# Altium schematic sheet Isolated_Power_supply.SchDoc: Power Supply (part 1 of 3)
size A2; Author: M.Beldyga; CompanyName: WUT ISE; DrawnBy: M.Beldyga; Organization: WUT ISE; Address1: PW ISE; Address2: Nowowiejska 15/19 00-665 Warsaw; Address3: micbeldyga@gmail.com; SheetNumber: 8; SheetTotal: 10; ModifiedBy: -; CheckedDate: -; Title2: LLC + LDO; DivGrp: WUT ISE; Designer: M.Beldyga; ModifiedDate: -; ProjectName: Sensor Box
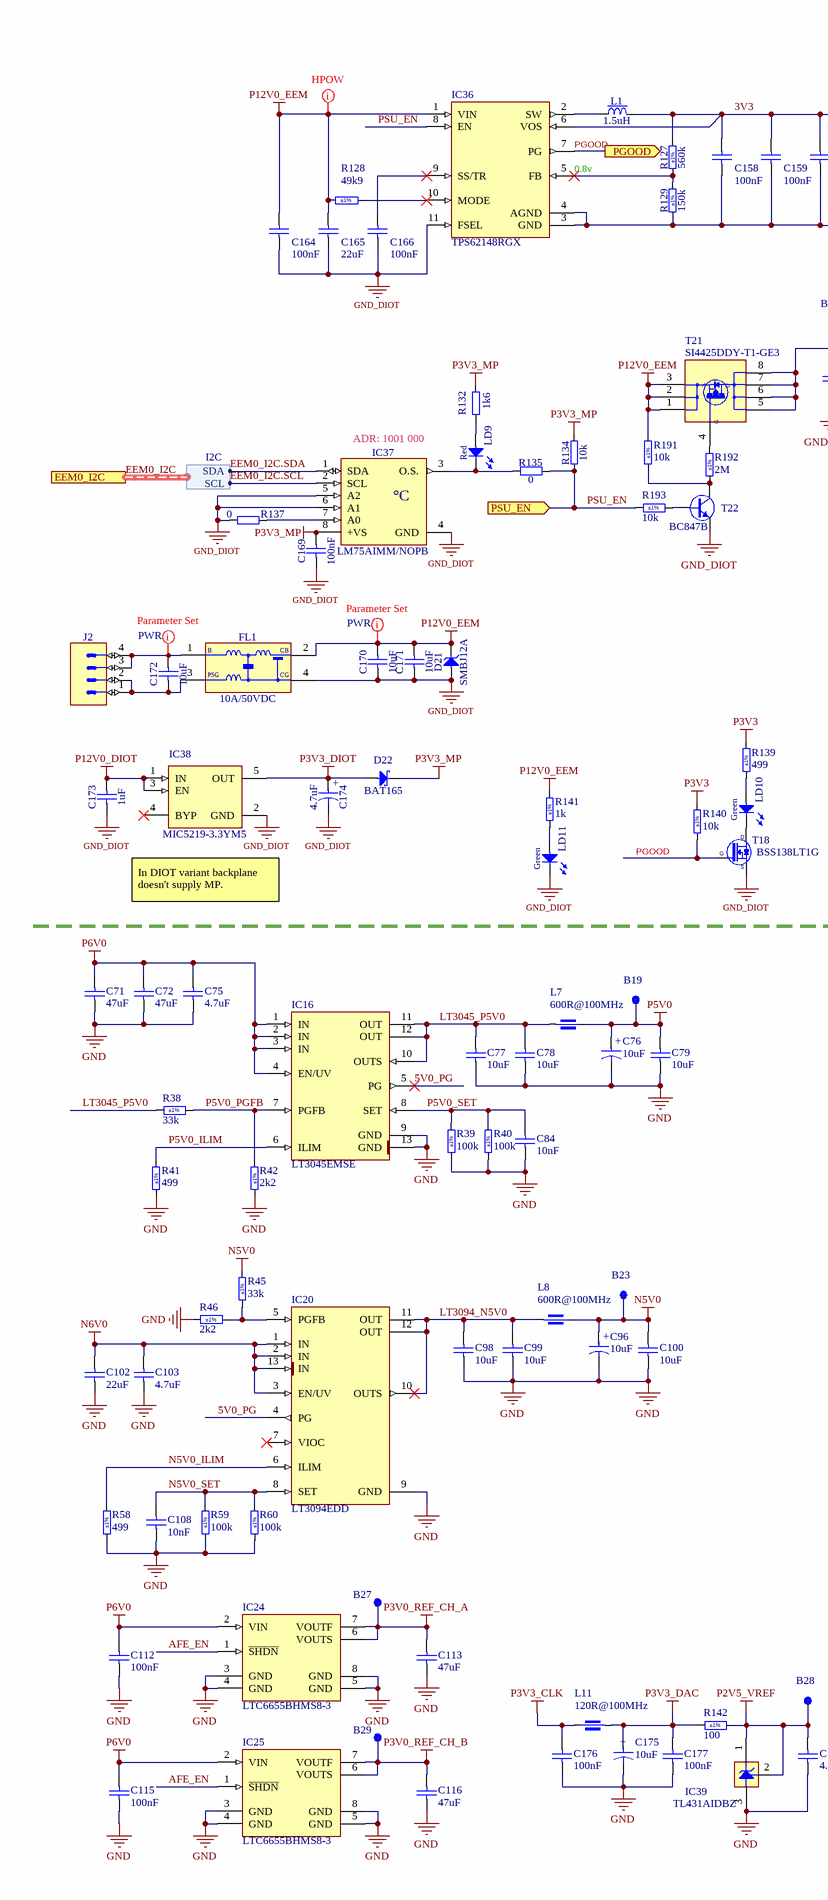
[diagram p0: Isolated_Power_supply.SchDoc, left]
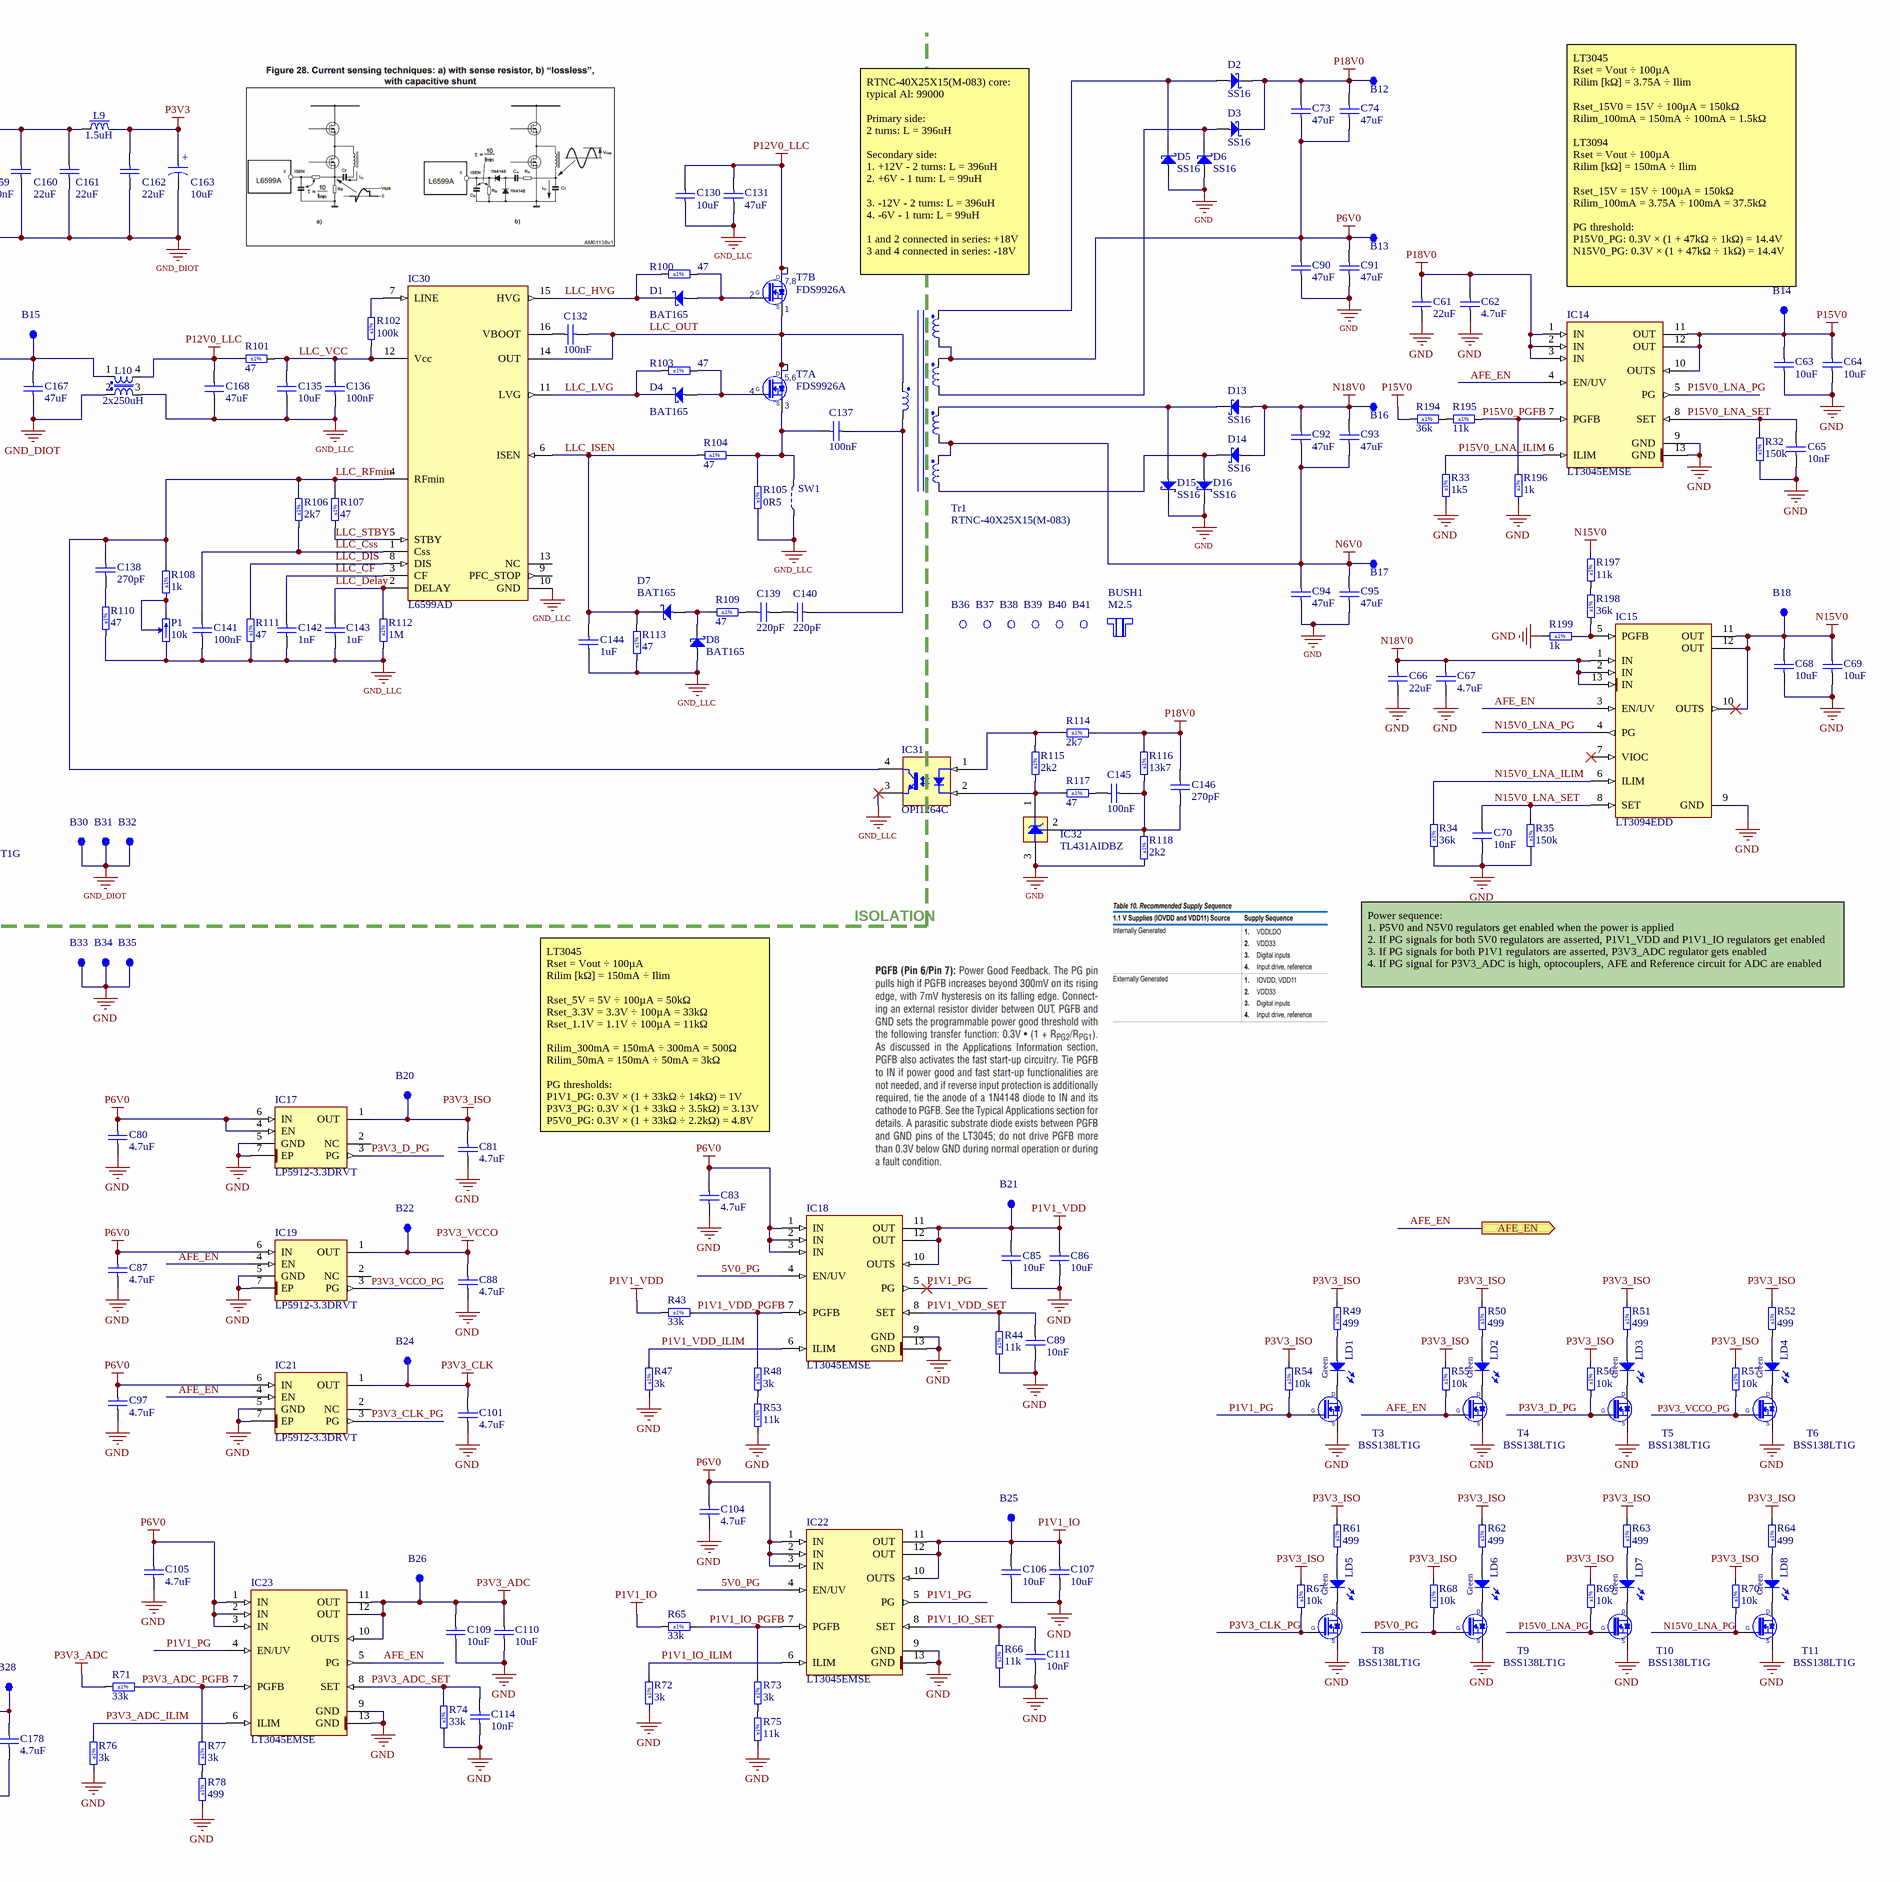
[diagram p1: Isolated_Power_supply.SchDoc, right]

## Parts
B12  SMD Pad  [C100]  (value not drawn)  (no BOM)
B13  SMD Pad  [C100]  (value not drawn)  (no BOM)
B14  SMD Pad  [C100]  (value not drawn)  (no BOM)
B15  SMD Pad  [C100]  (value not drawn)  (no BOM)
B16  SMD Pad  [C100]  (value not drawn)  (no BOM)
B17  SMD Pad  [C100]  (value not drawn)  (no BOM)
B18  SMD Pad  [C100]  (value not drawn)  (no BOM)
B19  SMD Pad  [C100]  (value not drawn)  (no BOM)
B20  SMD Pad  [C100]  (value not drawn)  (no BOM)
B21  SMD Pad  [C100]  (value not drawn)  (no BOM)
B22  SMD Pad  [C100]  (value not drawn)  (no BOM)
B23  SMD Pad  [C100]  (value not drawn)  (no BOM)
B24  SMD Pad  [C100]  (value not drawn)  (no BOM)
B25  SMD Pad  [C100]  (value not drawn)  (no BOM)
B26  SMD Pad  [C100]  (value not drawn)  (no BOM)
B27  SMD Pad  [C100]  (value not drawn)  (no BOM)
B28  SMD Pad  [C100]  (value not drawn)  (no BOM)
B29  SMD Pad  [C100]  (value not drawn)  (no BOM)
B30  SMD Pad  [C100]  (value not drawn)  (no BOM)
B31  SMD Pad  [C100]  (value not drawn)  (no BOM)
B32  SMD Pad  [C100]  (value not drawn)  (no BOM)
B33  SMD Pad  [C100]  (value not drawn)  (no BOM)
B34  SMD Pad  [C100]  (value not drawn)  (no BOM)
B35  SMD Pad  [C100]  (value not drawn)  (no BOM)
B36  Non Plated Hole  [MTG300]  (value not drawn)  (no BOM)
B37  Non Plated Hole  [MTG300]  (value not drawn)  (no BOM)
B38  Non Plated Hole  [MTG300]  (value not drawn)  (no BOM)
B39  Non Plated Hole  [MTG300]  (value not drawn)  (no BOM)
B40  Non Plated Hole  [MTG300]  (value not drawn)  (no BOM)
B41  Non Plated Hole  [MTG300]  (value not drawn)  (no BOM)
BUSH1  M2.5  [WURTH_9774010151]
C61  22uF  [CAPC2012X135N]
C62  4.7uF  [CAPC1608X90N]
C63  10uF  [CAPC2012X95N]
C64  10uF  [CAPC2012X95N]
C65  10nF  [CAPC1005X55N]
C66  22uF  [CAPC2012X135N]
C67  4.7uF  [CAPC1608X90N]
C68  10uF  [CAPC2012X95N]
C69  10uF  [CAPC2012X95N]
C70  10nF  [CAPC1005X55N]
C71  47uF  [CAPC3216X180N]
C72  47uF  [CAPC3216X180N]
C73  47uF  [CAPC3216X180N]
C74  47uF  [CAPC3216X180N]
C75  4.7uF  [CAPC1608X90N]
C76  10uF  [CAPMP3216X180N]
C77  10uF  [CAPC2012X95N]
C78  10uF  [CAPC2012X95N]
C79  10uF  [CAPC2012X95N]
C80  4.7uF  [CAPC1608X90N]
C81  4.7uF  [CAPC1608X90N]
C83  4.7uF  [CAPC1608X90N]
C84  10nF  [CAPC1005X55N]
C85  10uF  [CAPC2012X95N]
C86  10uF  [CAPC2012X95N]
C87  4.7uF  [CAPC1608X90N]
C88  4.7uF  [CAPC1608X90N]
C89  10nF  [CAPC1005X55N]
C90  47uF  [CAPC3216X180N]
C91  47uF  [CAPC3216X180N]
C92  47uF  [CAPC3216X180N]
C93  47uF  [CAPC3216X180N]
C94  47uF  [CAPC3216X180N]
C95  47uF  [CAPC3216X180N]
C96  10uF  [CAPMP3216X180N]
C97  4.7uF  [CAPC1608X90N]
C98  10uF  [CAPC2012X95N]
C99  10uF  [CAPC2012X95N]
C100  10uF  [CAPC2012X95N]
C101  4.7uF  [CAPC1608X90N]
C102  22uF  [CAPC2012X135N]
C103  4.7uF  [CAPC1608X90N]
C104  4.7uF  [CAPC1608X90N]
C105  4.7uF  [CAPC1608X90N]
C106  10uF  [CAPC2012X95N]
C107  10uF  [CAPC2012X95N]
C108  10nF  [CAPC1005X55N]
C109  10uF  [CAPC2012X95N]
C110  10uF  [CAPC2012X95N]
C111  10nF  [CAPC1005X55N]
C112  100nF  [CAPC1005X55N]
C113  47uF  [CAPC2012X140N]
C114  10nF  [CAPC1005X55N]
C115  100nF  [CAPC1005X55N]
C116  47uF  [CAPC2012X140N]
C130  10uF  [CAPC3216X180N]
C131  47uF  [CAPC3216X180N]
C132  100nF  [CAPC1005X55N]
C135  10uF  [CAPC3216X180N]
C136  100nF  [CAPC1005X55N]
C137  100nF  [CAPC4532X250N]
C138  270pF  [CAPC1608X87N]
C139  220pF  [CAPC3225X200N]
C140  220pF  [CAPC3225X200N]
C141  100nF  [CAPC1005X55N]
C142  1nF  [CAPC1608X90N]
C143  1uF  [CAPC1608X87N]
C144  1uF  [CAPC1608X87N]
C145  100nF  [CAPC1005X55N]
C146  270pF  [CAPC1608X87N]
C158  100nF  [CAPC1005X55N]
C159  100nF  [CAPC1005X55N]
C160  22uF  [CAPC2012X135N]
C161  22uF  [CAPC2012X135N]
C162  22uF  [CAPC2012X135N]
C163  10uF  [CAPMP3216X180N]
C164  100nF  [CAPC1005X55N]
C165  22uF  [CAPC2012X135N]
C166  100nF  [CAPC1005X55N]
C167  47uF  [CAPC3216X180N]
C168  47uF  [CAPC3216X180N]
C169  100nF  [CAPC1005X55N]
C170  10uF  [CAPC2012X95N]
C171  10uF  [CAPC2012X95N]
C172  10uF  [CAPC2012X95N]
C173  1uF  [CAPC1608X87N]
C174  4.7uF  [CAPMP3216X180N]
C175  10uF  [CAPMP3216X180N]
C176  100nF  [CAPC1005X55N]
C177  100nF  [CAPC1005X55N]
C178  4.7uF  [CAPC1608X90N]
D1  BAT165  [SOD2512X110N]
D2  SS16  [DIOM5127X229N]
D3  SS16  [DIOM5127X229N]
D4  BAT165  [SOD2512X110N]
D5  SS16  [DIOM5127X229N]
D6  SS16  [DIOM5127X229N]
D7  BAT165  [SOD2512X110N]
D8  BAT165  [SOD2512X110N]
D13  SS16  [DIOM5127X229N]
D14  SS16  [DIOM5127X229N]
D15  SS16  [DIOM5127X229N]
D16  SS16  [DIOM5127X229N]
D21  SMBJ12A  [DIOM5336X265N]
D22  BAT165  [SOD2512X110N]
FL1  10A/50VDC  [FIL_MURATA_BNX02]
IC14  LT3045EMSE  [SOP65P490X110-13N-R175X294]
IC15  LT3094EDD  [SON45P300X300X80-13N-R175X248]
IC16  LT3045EMSE  [SOP65P490X110-13N-R175X294]
IC17  LP5912-3.3DRVT  [SON65P200X200X80-7N-R110X170]
IC18  LT3045EMSE  [SOP65P490X110-13N-R175X294]
IC19  LP5912-3.3DRVT  [SON65P200X200X80-7N-R110X170]
IC20  LT3094EDD  [SON45P300X300X80-13N-R175X248]
IC21  LP5912-3.3DRVT  [SON65P200X200X80-7N-R110X170]
IC22  LT3045EMSE  [SOP65P490X110-13N-R175X294]
IC23  LT3045EMSE  [SOP65P490X110-13N-R175X294]
IC24  LTC6655BHMS8-3  [SOP65P490X110-8N]
IC25  LTC6655BHMS8-3  [SOP65P490X110-8N]
IC30  L6599AD  [SOP127P600X175-16N]
IC31  OPI1264C  [OPI1264C]
IC32  TL431AIDBZ  [SOT95P237X112-3N]
IC36  TPS62148RGX  [TEXAS_RGX0011A]
IC37  LM75AIMM/NOPB  [SOP65P490X109-8N]
IC38  MIC5219-3.3YM5  [SOT95P280X145-5N]
IC39  TL431AIDBZ  [SOT95P237X112-3N]
J2  Mini-Fit Jr.™  [MOLEX_39-30-0040]  (value not drawn)
L1  1.5uH  [IND_WURTH_WE-LHMI_7050]
L7  600R@100MHz  [INDC1608X95N]
L8  600R@100MHz  [INDC1608X95N]
L9  1.5uH  [IND_WURTH_WE-LHMI_7050]
L10  2x250uH  [IND_WURTH_WE-SL2]
L11  120R@100MHz  [INDC1608X65N]
LD1  Green  [LED_KINGBRIGHT_KP-1608CGCK]
LD2  Green  [LED_KINGBRIGHT_KP-1608CGCK]
LD3  Green  [LED_KINGBRIGHT_KP-1608CGCK]
LD4  Green  [LED_KINGBRIGHT_KP-1608CGCK]
LD5  Green  [LED_KINGBRIGHT_KP-1608CGCK]
LD6  Green  [LED_KINGBRIGHT_KP-1608CGCK]
LD7  Green  [LED_KINGBRIGHT_KP-1608CGCK]
LD8  Green  [LED_KINGBRIGHT_KP-1608CGCK]
LD9  Red  [LED_AVAGO_HSMC-C110]
LD10  Green  [LED_KINGBRIGHT_KP-1608CGCK]
LD11  Green  [LED_AVAGO_HSME-C110]
P1  10k  [TRIM_BOURNS_3314G-1]
R32  150k  Tolerance: ±1%  [RESC1005X40N]
R33  1k5  Tolerance: ±1%  [RESC1005X40N]
R34  36k  Tolerance: ±1%  [RESC1005X40N]
R35  150k  Tolerance: ±1%  [RESC1005X40N]
R38  33k  Tolerance: ±1%  [RESC1005X40N]
R39  100k  Tolerance: ±1%  [RESC1005X40N]
R40  100k  Tolerance: ±1%  [RESC1005X40N]
R41  499  Tolerance: ±1%  [RESC1005X40N]
R42  2k2  Tolerance: ±1%  [RESC1005X40N]
R43  33k  Tolerance: ±1%  [RESC1005X40N]
R44  11k  Tolerance: ±1%  [RESC1005X40N]
R45  33k  Tolerance: ±1%  [RESC1005X40N]
R46  2k2  Tolerance: ±1%  [RESC1005X40N]
R47  3k  Tolerance: ±1%  [RESC1005X40N]
R48  3k  Tolerance: ±1%  [RESC1005X40N]
R49  499  Tolerance: ±1%  [RESC1005X40N]
R50  499  Tolerance: ±1%  [RESC1005X40N]
R51  499  Tolerance: ±1%  [RESC1005X40N]
R52  499  Tolerance: ±1%  [RESC1005X40N]
R53  11k  Tolerance: ±1%  [RESC1005X40N]
R54  10k  Tolerance: ±1%  [RESC1005X40N]
R55  10k  Tolerance: ±1%  [RESC1005X40N]
R56  10k  Tolerance: ±1%  [RESC1005X40N]
R57  10k  Tolerance: ±1%  [RESC1005X40N]
R58  499  Tolerance: ±1%  [RESC1005X40N]
R59  100k  Tolerance: ±1%  [RESC1005X40N]
R60  100k  Tolerance: ±1%  [RESC1005X40N]
R61  499  Tolerance: ±1%  [RESC1005X40N]
R62  499  Tolerance: ±1%  [RESC1005X40N]
R63  499  Tolerance: ±1%  [RESC1005X40N]
R64  499  Tolerance: ±1%  [RESC1005X40N]
R65  33k  Tolerance: ±1%  [RESC1005X40N]
R66  11k  Tolerance: ±1%  [RESC1005X40N]
R67  10k  Tolerance: ±1%  [RESC1005X40N]
R68  10k  Tolerance: ±1%  [RESC1005X40N]
R69  10k  Tolerance: ±1%  [RESC1005X40N]
R70  10k  Tolerance: ±1%  [RESC1005X40N]
R71  33k  Tolerance: ±1%  [RESC1005X40N]
R72  3k  Tolerance: ±1%  [RESC1005X40N]
R73  3k  Tolerance: ±1%  [RESC1005X40N]
R74  33k  Tolerance: ±1%  [RESC1005X40N]
R75  11k  Tolerance: ±1%  [RESC1005X40N]
R76  3k  Tolerance: ±1%  [RESC1005X40N]
R77  3k  Tolerance: ±1%  [RESC1005X40N]
R78  499  Tolerance: ±1%  [RESC1005X40N]
R100  47  Tolerance: ±1%  [RESC1608X55N]
R101  47  Tolerance: ±1%  [RESC1608X55N]
R102  100k  Tolerance: ±1%  [RESC1005X40N]
R103  47  Tolerance: ±1%  [RESC1608X55N]
R104  47  Tolerance: ±1%  [RESC1608X55N]
R105  0R5  Tolerance: ±1%  [RESC6532X80N]
R106  2k7  Tolerance: ±1%  [RESC1608X55N]
R107  47  Tolerance: ±1%  [RESC1608X55N]
R108  1k  Tolerance: ±1%  [RESC1005X40N]
R109  47  Tolerance: ±1%  [RESC1608X55N]
R110  47  Tolerance: ±1%  [RESC1608X55N]
R111  47  Tolerance: ±1%  [RESC1608X55N]
R112  1M  Tolerance: ±1%  [RESC1608X55N]
R113  47  Tolerance: ±1%  [RESC1608X55N]
R114  2k7  Tolerance: ±1%  [RESC1608X55N]
R115  2k2  Tolerance: ±1%  [RESC1005X40N]
R116  13k7  Tolerance: ±1%  [RESC1608X55N]
R117  47  Tolerance: ±1%  [RESC1608X55N]
R118  2k2  Tolerance: ±1%  [RESC1005X40N]
R127  560k  Tolerance: ±1%  [RESC1608X55N]
R128  49k9  Tolerance: ±1%  [RESC1608X55N]
R129  150k  Tolerance: ±1%  [RESC1608X55N]
R132  1k6  [RESC1005X40N]
R134  10k  [RESC1608X55N]
R135  0  [RESC1005X40N]
R137  0  [RESC1005X40N]
R139  499  Tolerance: ±1%  [RESC1005X40N]
R140  10k  Tolerance: ±1%  [RESC1005X40N]
R141  1k  Tolerance: ±1%  [RESC1005X40N]
R142  100  Tolerance: ±1%  [RESC1005X40N]
R191  10k  Tolerance: ±1%  [RESC1005X40N]
R192  2M  Tolerance: ±1%  [RESC1005X40N]
R193  10k  Tolerance: ±1%  [RESC1005X40N]
R194  36k  Tolerance: ±1%  [RESC1005X40N]
R195  11k  Tolerance: ±1%  [RESC1005X40N]
R196  1k  Tolerance: ±1%  [RESC1005X40N]
R197  11k  Tolerance: ±1%  [RESC1005X40N]
R198  36k  Tolerance: ±1%  [RESC1005X40N]
R199  1k  Tolerance: ±1%  [RESC1005X40N]
SW1  Switch  [JUMPSMD0805_G50]  (value not drawn)  (no BOM)
T3  BSS138LT1G  [SOT95P240X110-3N]
T4  BSS138LT1G  [SOT95P240X110-3N]
T5  BSS138LT1G  [SOT95P240X110-3N]
T6  BSS138LT1G  [SOT95P240X110-3N]
T7  FDS9926A  [SOIC127P600X175-8N]  (parts A,B of 2)
T8  BSS138LT1G  [SOT95P240X110-3N]
T9  BSS138LT1G  [SOT95P240X110-3N]
T10  BSS138LT1G  [SOT95P240X110-3N]
T11  BSS138LT1G  [SOT95P240X110-3N]
T18  BSS138LT1G  [SOT95P240X110-3N]
T21  SI4425DDY-T1-GE3  [SOIC127P600X175-8N]
T22  BC847B  [SOT95P230X110-3N]
Tr1  RTNC-40X25X15(M-083)  [RTNC-40X25X15(M-083)]

## Ports
AFE_EN (out), EEM0_I2C (harness I2C), PGOOD (out), PSU_EN (in)

## Harnesses
I2C: SDA, SCL

## Nets
GND: B33.1 B34.1 B35.1 C61.1 C62.1 C63.1 C64.1 C65.1 C66.1 C67.1 C68.1 C69.1 C70.1 C71.1 C72.1 C75.1 C76.2 C77.1 C78.1 C79.1 C80.1 C81.1 C83.1 C84.1 C85.1 C86.1 C87.1 C88.1 C89.1 C90.2 C91.2 C94.2 C95.2 C96.2 C97.1 C98.1 C99.1 C100.1 C101.1 C102.1 C103.1 C104.1 C105.1 C106.1 C107.1 C108.1 C109.1 C110.1 C111.1 C112.1 C113.1 C114.1 C115.1 C116.1 C175.2 C176.1 C177.1 C178.1 D5.2(A) D6.2(A) D15.1(C) D16.1(C) IC14.9(GND) IC14.13(GND) IC15.9(GND) IC16.9(GND) IC16.13(GND) IC17.5(GND) IC17.7(EP) IC18.9(GND) IC18.13(GND) IC19.5(GND) IC19.7(EP) IC20.9(GND) IC21.5(GND) IC21.7(EP) IC22.9(GND) IC22.13(GND) IC23.9(GND) IC23.13(GND) IC24.3(GND) IC24.4(GND) IC24.5(GND) IC24.8(GND) IC25.3(GND) IC25.4(GND) IC25.5(GND) IC25.8(GND) IC32.3(A) IC39.3(A) R32.1 R33.1 R34.1 R35.1 R39.1 R40.1 R41.1 R42.1 R44.1 R46.2 R47.1 R53.1 R58.1 R59.1 R60.1 R66.1 R72.1 R74.1 R75.1 R76.1 R78.1 R118.1 R196.1 R199.2 T3.2(S) T4.2(S) T5.2(S) T6.2(S) T8.2(S) T9.2(S) T10.2(S) T11.2(S)
GND_DIOT: B30.1 B31.1 B32.1 C158.1 C159.1 C160.1 C161.1 C162.1 C163.2 C164.1 C165.1 C166.1 C167.1 C169.1 C170.1 C171.1 C173.1 C174.2 D21.2(A) FL1.4(CG) IC36.3(GND) IC36.4(AGND) IC36.11(FSEL) IC37.4(GND) IC37.5(A2) IC37.6(A1) IC38.2(GND) L10.2 LD11.1(C) R129.1 R137.1 T18.2(S) T22.2(E)
GND_LLC: C130.2 C131.2 C135.2 C136.1 C141.2 C142.1 C143.1 C144.1 C168.1 D8.2(A) IC30.10(GND) IC31.3(E) L10.3 P1.1(CCW) R105.1 R110.1 R111.1 R112.1 R113.1 SW1.1
N5V0: B23.1 C96.1 C100.2 L8.2 R45.2
N6V0: B17.1 C92.2 C93.2 C94.1 C95.1 C102.2 C103.2 IC20.1(IN) IC20.2(IN) IC20.3(EN/UV) IC20.13(IN) Tr1.8 Tr1.9
N15V0: B18.1 C68.2 C69.2 IC15.10(OUTS) IC15.11(OUT) IC15.12(OUT) R197.2
N18V0: B16.1 C66.2 C67.2 C92.1 C93.1 D13.2(A) D14.2(A) IC15.1(IN) IC15.2(IN) IC15.13(IN)
P1V1_IO: B25.1 C106.2 C107.2 IC22.10(OUTS) IC22.11(OUT) IC22.12(OUT) R65.2
P1V1_VDD: B21.1 C85.2 C86.2 IC18.10(OUTS) IC18.11(OUT) IC18.12(OUT) R43.2
P2V5_VREF: B28.1 C178.2 IC39.1(C) IC39.2(Adj) R142.1
P3V0_REF_CH_A: B27.1 C113.2 IC24.6(VOUTS) IC24.7(VOUTF)
P3V0_REF_CH_B: B29.1 C116.2 IC25.6(VOUTS) IC25.7(VOUTF)
P3V3: C162.2 C163.1 L9.2 R139.2 R140.2
P3V3_ADC: B26.1 C109.2 C110.2 IC23.10(OUTS) IC23.11(OUT) IC23.12(OUT) R71.2
P3V3_CLK: B24.1 C101.2 C176.2 IC21.1(OUT) L11.2
P3V3_DAC: C175.1 C177.2 L11.1 R142.2
P3V3_DIOT: C174.1 D22.2(A) IC38.5(OUT)
P3V3_ISO: B20.1 C81.2 IC17.1(OUT) R49.2 R50.2 R51.2 R52.2 R54.2 R55.2 R56.2 R57.2 R61.2 R62.2 R63.2 R64.2 R67.2 R68.2 R69.2 R70.2
P3V3_MP: C169.2 D22.1(C) IC37.8(+VS) R132.2 R134.2
P3V3_VCCO: B22.1 C88.2 IC19.1(OUT)
P5V0: B19.1 C76.1 C79.2 L7.2
P6V0: B13.1 C71.2 C72.2 C73.2 C74.2 C75.2 C80.2 C83.2 C87.2 C90.1 C91.1 C97.2 C104.2 C105.2 C112.2 C115.2 IC16.1(IN) IC16.2(IN) IC16.3(IN) IC16.4(EN/UV) IC17.4(EN) IC17.6(IN) IC18.1(IN) IC18.2(IN) IC18.3(IN) IC19.6(IN) IC21.6(IN) IC22.1(IN) IC22.2(IN) IC22.3(IN) IC23.1(IN) IC23.2(IN) IC23.3(IN) IC24.2(VIN) IC25.2(VIN) Tr1.4 Tr1.5
P12V0_DIOT: C173.2 IC38.1(IN) IC38.3(EN)
P12V0_EEM: C164.2 C165.2 C170.2 C171.2 D21.1(C) FL1.2(CB) IC36.1(VIN) R128.1 R141.2 R191.1 T21.1(S) T21.2(S) T21.3(S)
P12V0_LLC: C130.1 C131.1 C168.2 L10.4 R101.2 T7.7(D) T7.8(D)
P15V0: B14.1 C63.2 C64.2 IC14.10(OUTS) IC14.11(OUT) IC14.12(OUT) R194.1
P18V0: B12.1 C61.2 C62.2 C73.1 C74.1 C146.2 D2.1(C) D3.1(C) IC14.1(IN) IC14.2(IN) IC14.3(IN) R114.1 R116.2
3V3: C158.2 C159.2 C160.2 C161.2 IC36.6(VOS) L1.2 L9.1 R127.2
5V0_PG: IC16.5(PG) IC18.4(EN/UV) IC20.4(PG) IC22.4(EN/UV)
AFE_EN: IC14.4(EN/UV) IC15.3(EN/UV) IC19.4(EN) IC21.4(EN) IC23.5(PG) IC24.1(~{SHDN}) IC25.1(~{SHDN}) R55.1 T4.1(G) ; port AFE_EN
EEM0_I2C.SCL: IC37.2(SCL) ; port EEM0_I2C.SCL
EEM0_I2C.SDA: IC37.1(SDA) ; port EEM0_I2C.SDA
LLC_CF: C142.2 IC30.3(CF)
LLC_Css: C141.1 IC30.1(Css) R106.1
LLC_Delay: C143.2 IC30.2(DELAY) R112.2
LLC_DIS: IC30.8(DIS) R111.2
LLC_HVG: D1.1(C) IC30.15(HVG) R100.1
LLC_ISEN: C144.2 D7.1(C) IC30.6(ISEN) R104.2 R113.2
LLC_LVG: D4.1(C) IC30.11(LVG) R103.1
LLC_OUT: C132.1 IC30.14(OUT) T7.1(S) T7.5(D) T7.6(D) Tr1.1
LLC_RFmin: C138.2 IC30.4(RFmin) IC31.4(C) R106.2 R107.2 R108.2
LLC_STBY: IC30.5(STBY) R107.1
LLC_VCC: C135.1 C136.2 IC30.12(Vcc) R101.1 R102.1
LT3045_P5V0: C77.2 C78.2 IC16.10(OUTS) IC16.11(OUT) IC16.12(OUT) L7.1 R38.2
LT3094_N5V0: C98.2 C99.2 IC20.10(OUTS) IC20.11(OUT) IC20.12(OUT) L8.1
N5V0_ILIM: IC20.6(ILIM) R58.2
N5V0_SET: C108.2 IC20.8(SET) R59.2 R60.2
N15V0_LNA_ILIM: IC15.6(ILIM) R34.2
N15V0_LNA_PG: IC15.4(PG) R70.1 T11.1(G)
N15V0_LNA_SET: C70.2 IC15.8(SET) R35.2
P1V1_IO_ILIM: IC22.6(ILIM) R72.2
P1V1_IO_PGFB: IC22.7(PGFB) R65.1 R73.2
P1V1_IO_SET: C111.2 IC22.8(SET) R66.2
P1V1_PG: IC18.5(PG) IC22.5(PG) IC23.4(EN/UV) R54.1 T3.1(G)
P1V1_VDD_ILIM: IC18.6(ILIM) R47.2
P1V1_VDD_PGFB: IC18.7(PGFB) R43.1 R48.2
P1V1_VDD_SET: C89.2 IC18.8(SET) R44.2
P3V3_ADC_ILIM: IC23.6(ILIM) R76.2
P3V3_ADC_PGFB: IC23.7(PGFB) R71.1 R77.2
P3V3_ADC_SET: C114.2 IC23.8(SET) R74.2
P3V3_CLK_PG: IC21.3(PG) R67.1 T8.1(G)
P3V3_D_PG: IC17.3(PG) R56.1 T5.1(G)
P3V3_VCCO_PG: IC19.3(PG) R57.1 T6.1(G)
P5V0_ILIM: IC16.6(ILIM) R41.2
P5V0_PG: R68.1 T9.1(G)
P5V0_PGFB: IC16.7(PGFB) R38.1 R42.2
P5V0_SET: C84.2 IC16.8(SET) R39.2 R40.2
P15V0_LNA_ILIM: IC14.6(ILIM) R33.2
P15V0_LNA_PG: IC14.5(PG) R69.1 T10.1(G)
P15V0_LNA_SET: C65.2 IC14.8(SET) R32.2
P15V0_PGFB: IC14.7(PGFB) R195.2 R196.2
PGOOD: IC36.7(PG) R140.1 T18.1(G) ; port PGOOD
PSU_EN: IC36.8(EN) R134.1 R135.2 R193.2 ; port PSU_EN
NetB15_1: B15.1 C167.2 L10.1 T21.5(D) T21.6(D) T21.7(D) T21.8(D)
NetC132_2: C132.2 IC30.16(VBOOT)
NetC137_1: C137.1 R104.1 R105.2 SW1.2 T7.3(S)
NetC137_2: C137.2 C140.2 Tr1.2
NetC138_1: C138.1 R110.2
NetC139_1: C139.1 R109.1
NetC139_2: C139.2 C140.1
NetC145_1: C145.1 C146.1 IC32.2(Adj) R116.1 R118.2
NetC145_2: C145.2 R117.1
NetC166_2: C166.2 IC36.9(SS/TR)
NetC172_1: C172.1 FL1.3(PSG) J2.1 J2.2
NetC172_2: C172.2 FL1.1(B) J2.3 J2.4
NetD1_2: D1.2(A) R100.2 T7.2(G)
NetD2_2: D2.2(A) D5.1(C) Tr1.3
NetD3_2: D3.2(A) D6.1(C) Tr1.6
NetD4_2: D4.2(A) R103.2 T7.4(G)
NetD7_2: D7.2(A) D8.1(C) R109.2
NetD13_1: D13.1(C) D15.2(A) Tr1.7
NetD14_1: D14.1(C) D16.2(A) Tr1.10
NetIC15_5: IC15.5(PGFB) R198.1 R199.1
NetIC20_5: IC20.5(PGFB) R45.1 R46.1
NetIC30_7: IC30.7(LINE) R102.2
NetIC31_1: IC31.1(A) R114.2 R115.2
NetIC31_2: IC31.2(C) IC32.1(C) R115.1 R117.2
NetIC36_2: IC36.2(SW) L1.1
NetIC36_5: IC36.5(FB) R127.1 R129.2
NetIC36_10: IC36.10(MODE) R128.2
NetIC37_3: IC37.3(O.S.) LD9.1(C) R135.1
NetIC37_7: IC37.7(A0) R137.2
NetLD1_1: LD1.1(C) T3.3(D)
NetLD1_2: LD1.2(A) R49.1
NetLD2_1: LD2.1(C) T4.3(D)
NetLD2_2: LD2.2(A) R50.1
NetLD3_1: LD3.1(C) T5.3(D)
NetLD3_2: LD3.2(A) R51.1
NetLD4_1: LD4.1(C) T6.3(D)
NetLD4_2: LD4.2(A) R52.1
NetLD5_1: LD5.1(C) T8.3(D)
NetLD5_2: LD5.2(A) R61.1
NetLD6_1: LD6.1(C) T9.3(D)
NetLD6_2: LD6.2(A) R62.1
NetLD7_1: LD7.1(C) T10.3(D)
NetLD7_2: LD7.2(A) R63.1
NetLD8_1: LD8.1(C) T11.3(D)
NetLD8_2: LD8.2(A) R64.1
NetLD9_2: LD9.2(A) R132.1
NetLD10_1: LD10.1(C) T18.3(D)
NetLD10_2: LD10.2(A) R139.1
NetLD11_2: LD11.2(A) R141.1
NetP1_2: P1.2(W) P1.3(CW) R108.1
NetR48_1: R48.1 R53.2
NetR73_1: R73.1 R75.2
NetR77_1: R77.1 R78.2
NetR191_2: R191.2 R192.1 T22.3(C)
NetR192_2: R192.2 T21.4(S)
NetR193_1: R193.1 T22.1(B)
NetR194_2: R194.2 R195.1
NetR197_1: R197.1 R198.2

Not connected (* = marked no-connect by the designer): B36 1; B37 1; B38 1; B39 1; B40 1; B41 1; BUSH1 1; IC15 7(VIOC)*; IC17 2(NC); IC19 2(NC); IC20 7(VIOC)*; IC21 2(NC); IC30 9(PFC_STOP) 13(NC); IC38 4(BYP)*

## Buses and harness runs
harness EEM0_I2C = port EEM0_I2C

## Layout directives
net class PWR: NetC172_2, P12V0_EEM
net class HPOW: P12V0_EEM

## Notes on the sheet
- (near IC36) 0.8v
- (near Tr1) RTNC-40X25X15(M-083) core:
  typical Al: 99000
  Primary side:
  2 turns: L = 396uH
  Secondary side:
  1. +12V - 2 turns: L = 396uH
  2. +6V - 1 turn: L = 99uH
  3. -12V - 2 turns: L = 396uH
  4. -6V - 1 turn: L = 99uH
  1 and 2 connected in series: +18V
  3 and 4 connected in series: -18V
- (near B14) LT3045
  Rset = Vout ÷ 100µA
  Rilim [kΩ] = 3.75A ÷ Ilim
  Rset_15V0 = 15V ÷ 100µA = 150kΩ
  Rilim_100mA = 150mA ÷ 100mA = 1.5kΩ
  LT3094
  Rset = Vout ÷ 100µA
  Rilim [kΩ] = 150mA ÷ Ilim
  Rset_15V = 15V ÷ 100µA = 150kΩ
  Rilim_100mA = 3.75A ÷ 100mA = 37.5kΩ
  PG threshold:
  P15V0_PG: 0.3V × (1 + 47kΩ ÷ 1kΩ) = 14.4V
  N15V0_PG: 0.3V × (1 + 47kΩ ÷ 1kΩ) = 14.4V
- (near IC37) ADR: 1001 000
- In DIOT variant backplane doesn't supply MP.
- ISOLATION
- Power sequence:
  1. P5V0 and N5V0 regulators get enabled when the power is applied
  2. If PG signals for both 5V0 regulators are asserted, P1V1_VDD and P1V1_IO regulators get enabled
  3. If PG signals for both P1V1 regulators are asserted, P3V3_ADC regulator gets enabled
  4. If PG signal for P3V3_ADC is high, optocouplers, AFE and Reference circuit for ADC are enabled
- LT3045
  Rset = Vout ÷ 100µA
  Rilim [kΩ] = 150mA ÷ Ilim
  Rset_5V = 5V ÷ 100µA = 50kΩ
  Rset_3.3V = 3.3V ÷ 100µA = 33kΩ
  Rset_1.1V = 1.1V ÷ 100µA = 11kΩ
  Rilim_300mA = 150mA ÷ 300mA = 500Ω
  Rilim_50mA = 150mA ÷ 50mA = 3kΩ
  PG thresholds:
  P1V1_PG: 0.3V × (1 + 33kΩ ÷ 14kΩ) = 1V
  P3V3_PG: 0.3V × (1 + 33kΩ ÷ 3.5kΩ) = 3.13V
  P5V0_PG: 0.3V × (1 + 33kΩ ÷ 2.2kΩ) = 4.8V
- Project/Equipment
- Document
- Designer
- Drawn by
- Check.by
- Last Mod.
- Contact
- File
- Print Date
- Sheet
- Size
- A2
- of
- Rev
- (in symbol CTE3216-18_4.7UF_10V_10%_AVX_TPSA475K010T1400) +
- (in symbol CTE3216-18_10UF_10V_10%_LESR1800) +
- (in symbol CTE3216-18_10UF_16V_20%_AVX_TCJ) +
- (in symbol FDS9926A, part A) 5,6
- (in symbol FDS9926A, part B) 7,8
- (in symbol LM75AIMM/NOPB) °C
- (in symbol Si4425DDY-T1-GE3) G